# EAGLE schematic BMS MiniCAN Themistor Board Rev. 5 (EAGLE 7.7.0)
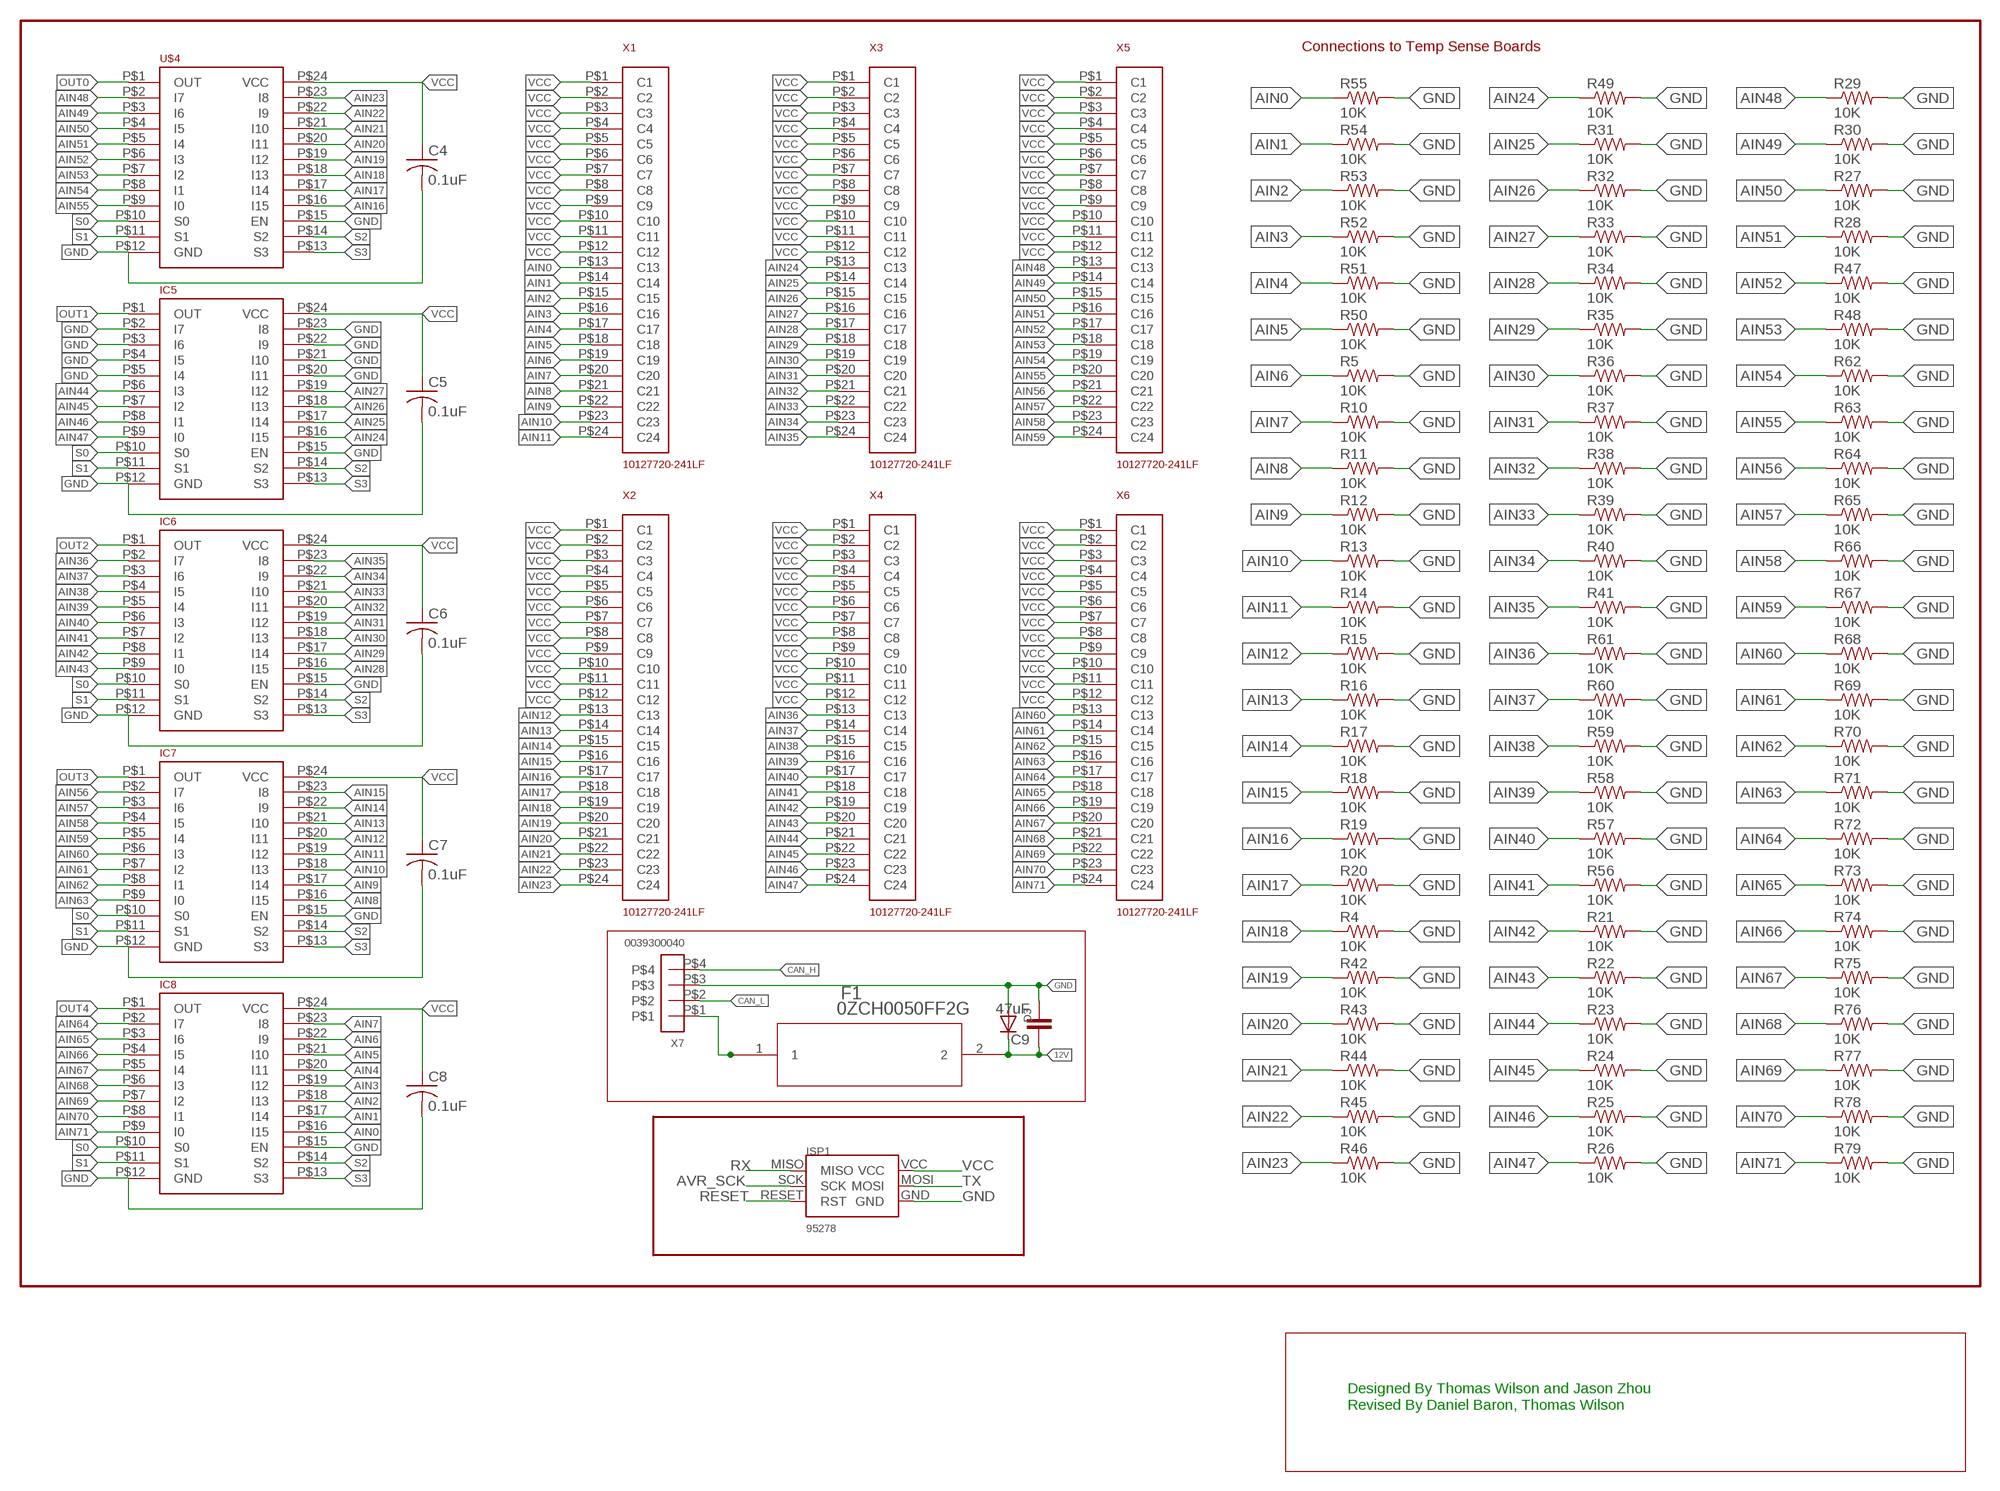
[diagram p0: schematic, sheet 1, part 1 of 2]
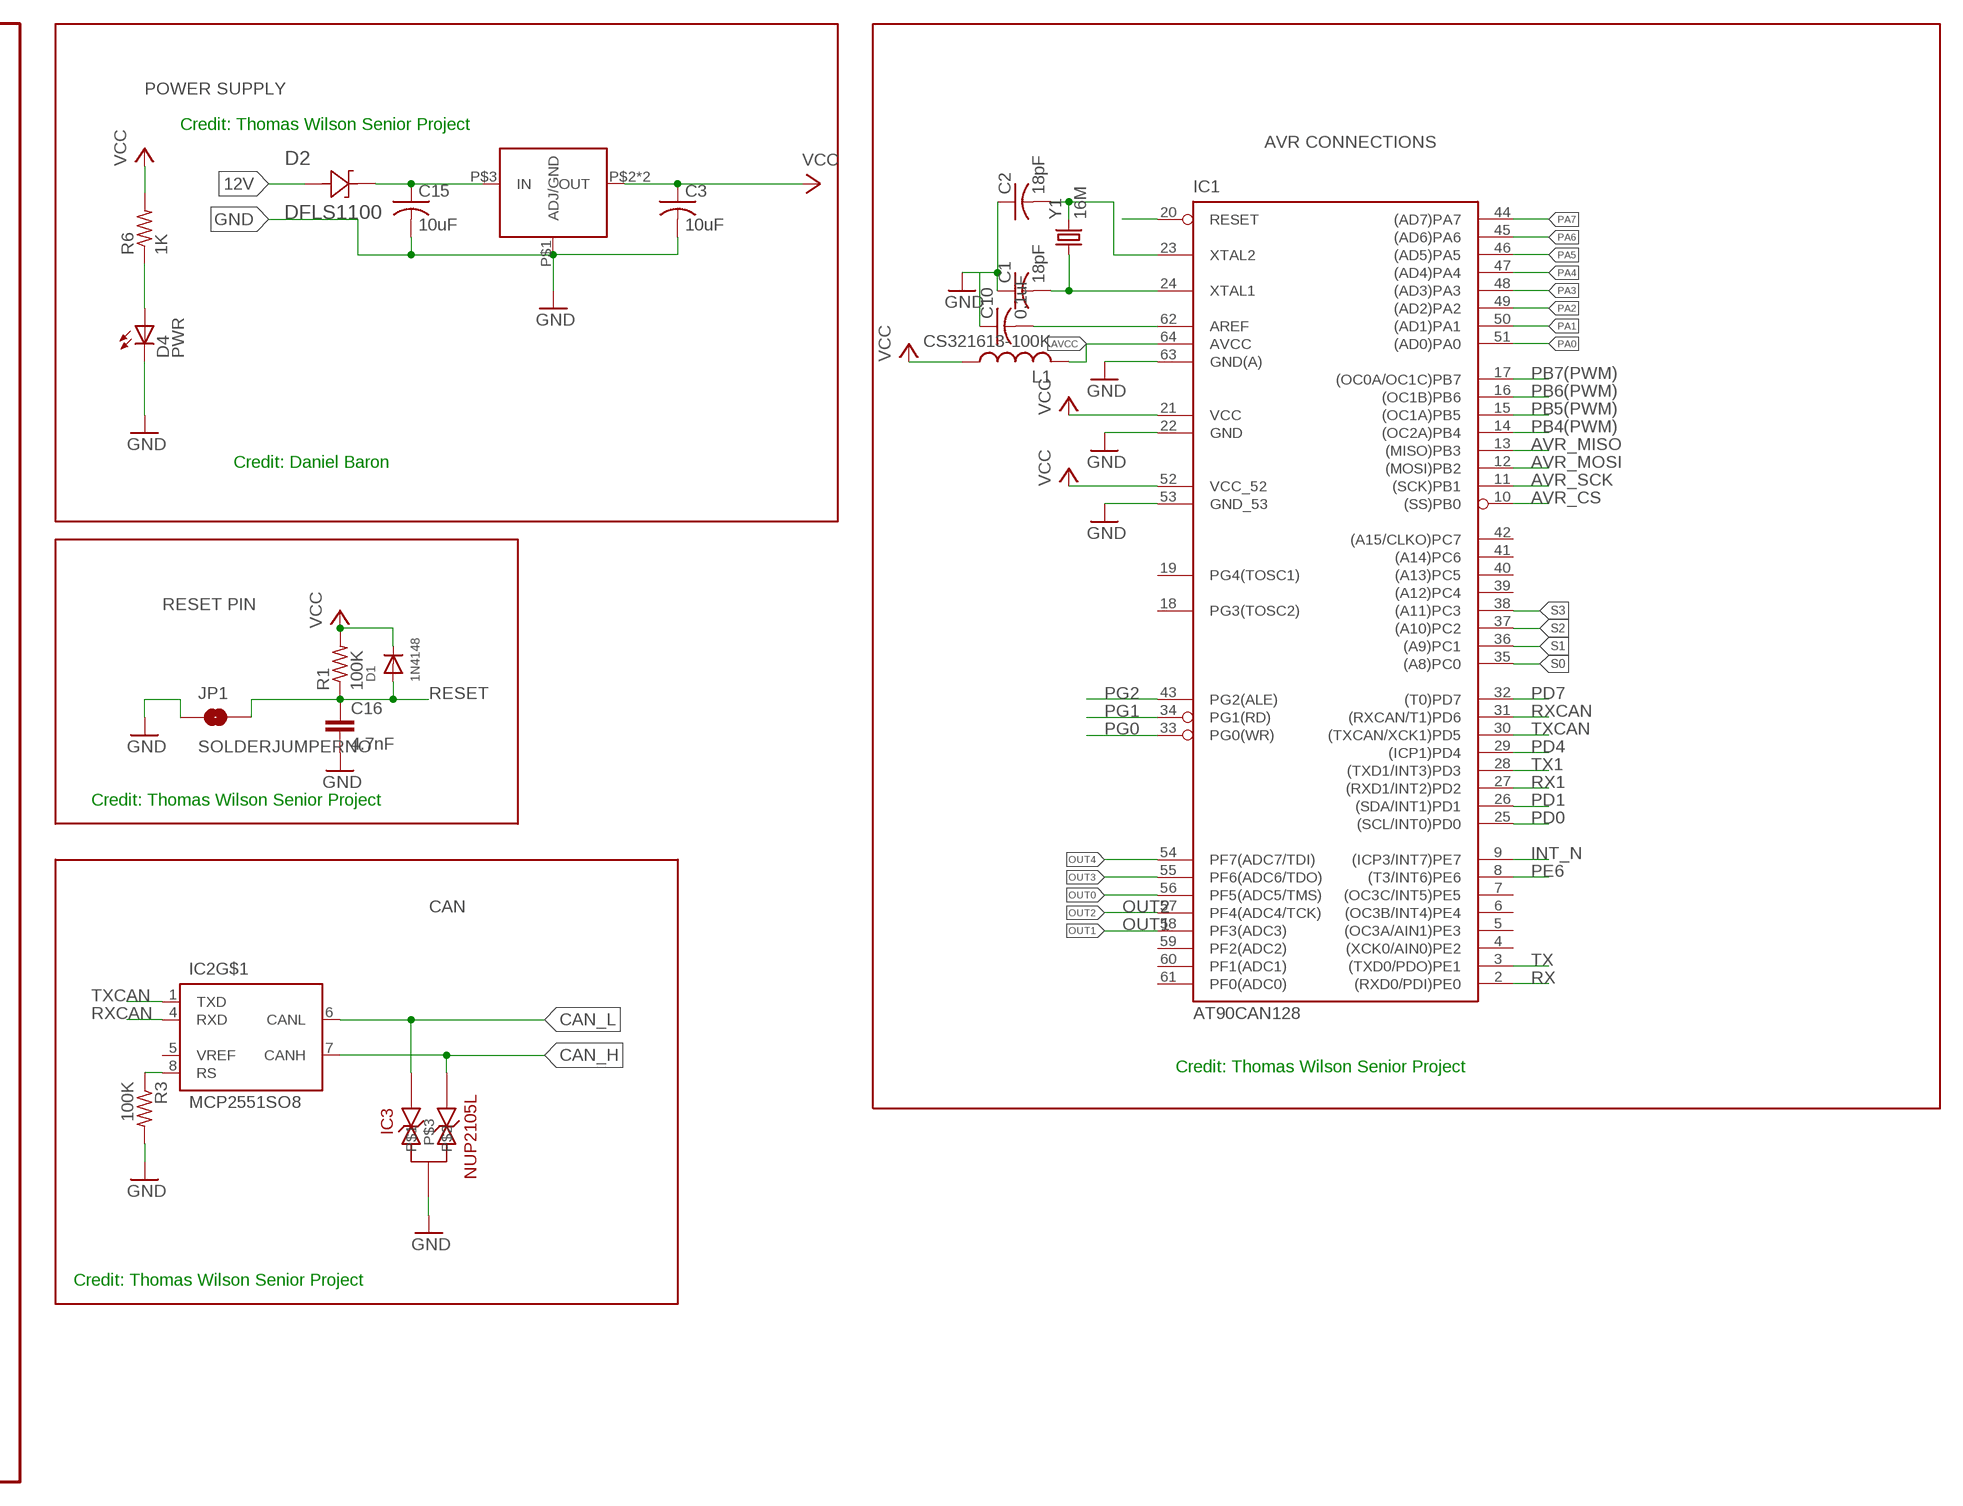
[diagram p1: schematic, sheet 1, part 2 of 2]

## Parts
C1  18pF  C-USC0805  [C0805]
C2  18pF  C-USC0805  [C0805]
C3  10uF  C-USC0805  [C0805]
C4  0.1uF  C-USC0805  [C0805]
C5  0.1uF  C-USC0805  [C0805]
C6  0.1uF  C-USC0805  [C0805]
C7  0.1uF  C-USC0805  [C0805]
C8  0.1uF  C-USC0805  [C0805]
C9  47uF  C-EUC0805  [C0805]
C10  0.1uF  C-USC0805  [C0805]
C15  10uF  C-USC0805  [C0805]
C16  4.7nF  CAP0603-CAP  [0603-CAP]
D1  1N4148  DIODESOD-123  [SOD-123]
D2  DFLS1100  [POWERDI-123]
D3  DIODESOD-323F  [SOD-323F]
D4  PWR  LEDCHIPLED_0805  [CHIPLED_0805]
F1  0ZCH0050FF2G  [0ZCH]
IC1  AT90CAN128  [TQFP64]
IC2  MCP2551SO8  [SO08]
IC3  NUP2105L  [SOT-23]
IC4  LM117MPX-5.0  [SOT223-4]
IC5  CD74HC4067  [24-SOIC]
IC6  CD74HC4067  [24-SOIC]
IC7  CD74HC4067  [24-SOIC]
IC8  CD74HC4067  [24-SOIC]
ISP1  95278  [6_PIN_.1PITCH]
JP1  SOLDERJUMPERNO  [SJ_2S-NO]
L1  CS321613-100K  L-USL3216C  [L3216C]
R1  100K  R-US_R0805  [R0805]
R3  100K  R-US_R0805  [R0805]
R4  10K  R-US_R0603  [R0603]
R5  10K  R-US_R0603  [R0603]
R6  1K  R-US_R0805  [R0805]
R10  10K  R-US_R0603  [R0603]
R11  10K  R-US_R0603  [R0603]
R12  10K  R-US_R0603  [R0603]
R13  10K  R-US_R0603  [R0603]
R14  10K  R-US_R0603  [R0603]
R15  10K  R-US_R0603  [R0603]
R16  10K  R-US_R0603  [R0603]
R17  10K  R-US_R0603  [R0603]
R18  10K  R-US_R0603  [R0603]
R19  10K  R-US_R0603  [R0603]
R20  10K  R-US_R0603  [R0603]
R21  10K  R-US_R0603  [R0603]
R22  10K  R-US_R0603  [R0603]
R23  10K  R-US_R0603  [R0603]
R24  10K  R-US_R0603  [R0603]
R25  10K  R-US_R0603  [R0603]
R26  10K  R-US_R0603  [R0603]
R27  10K  R-US_R0603  [R0603]
R28  10K  R-US_R0603  [R0603]
R29  10K  R-US_R0603  [R0603]
R30  10K  R-US_R0603  [R0603]
R31  10K  R-US_R0603  [R0603]
R32  10K  R-US_R0603  [R0603]
R33  10K  R-US_R0603  [R0603]
R34  10K  R-US_R0603  [R0603]
R35  10K  R-US_R0603  [R0603]
R36  10K  R-US_R0603  [R0603]
R37  10K  R-US_R0603  [R0603]
R38  10K  R-US_R0603  [R0603]
R39  10K  R-US_R0603  [R0603]
R40  10K  R-US_R0603  [R0603]
R41  10K  R-US_R0603  [R0603]
R42  10K  R-US_R0603  [R0603]
R43  10K  R-US_R0603  [R0603]
R44  10K  R-US_R0603  [R0603]
R45  10K  R-US_R0603  [R0603]
R46  10K  R-US_R0603  [R0603]
R47  10K  R-US_R0603  [R0603]
R48  10K  R-US_R0603  [R0603]
R49  10K  R-US_R0603  [R0603]
R50  10K  R-US_R0603  [R0603]
R51  10K  R-US_R0603  [R0603]
R52  10K  R-US_R0603  [R0603]
R53  10K  R-US_R0603  [R0603]
R54  10K  R-US_R0603  [R0603]
R55  10K  R-US_R0603  [R0603]
R56  10K  R-US_R0603  [R0603]
R57  10K  R-US_R0603  [R0603]
R58  10K  R-US_R0603  [R0603]
R59  10K  R-US_R0603  [R0603]
R60  10K  R-US_R0603  [R0603]
R61  10K  R-US_R0603  [R0603]
R62  10K  R-US_R0603  [R0603]
R63  10K  R-US_R0603  [R0603]
R64  10K  R-US_R0603  [R0603]
R65  10K  R-US_R0603  [R0603]
R66  10K  R-US_R0603  [R0603]
R67  10K  R-US_R0603  [R0603]
R68  10K  R-US_R0603  [R0603]
R69  10K  R-US_R0603  [R0603]
R70  10K  R-US_R0603  [R0603]
R71  10K  R-US_R0603  [R0603]
R72  10K  R-US_R0603  [R0603]
R73  10K  R-US_R0603  [R0603]
R74  10K  R-US_R0603  [R0603]
R75  10K  R-US_R0603  [R0603]
R76  10K  R-US_R0603  [R0603]
R77  10K  R-US_R0603  [R0603]
R78  10K  R-US_R0603  [R0603]
R79  10K  R-US_R0603  [R0603]
U$4  CD74HC4067  [24-SOIC]
X1  10127720-241LF  [10127720-241LF]
X2  10127720-241LF  [10127720-241LF]
X3  10127720-241LF  [10127720-241LF]
X4  10127720-241LF  [10127720-241LF]
X5  10127720-241LF  [10127720-241LF]
X6  10127720-241LF  [10127720-241LF]
X7  0039300040  [4_PIN_MOLEX]
Y1  16M  CRYSTALSMD  [HC49UP]

## Nets
12V: C9.1 D2.P$2 D3.C F1.2
12VIN: C15.1 D2.P$1 IC4.P$3(IN)
AIN0: IC8.P$16(I15) R55.1 X1.P$13(C13)
AIN1: IC8.P$17(I14) R54.1 X1.P$14(C14)
AIN2: IC8.P$18(I13) R53.1 X1.P$15(C15)
AIN3: IC8.P$19(I12) R52.1 X1.P$16(C16)
AIN4: IC8.P$20(I11) R51.1 X1.P$17(C17)
AIN5: IC8.P$21(I10) R50.1 X1.P$18(C18)
AIN6: IC8.P$22(I9) R5.1 X1.P$19(C19)
AIN7: IC8.P$23(I8) R10.1 X1.P$20(C20)
AIN8: IC7.P$16(I15) R11.1 X1.P$21(C21)
AIN9: IC7.P$17(I14) R12.1 X1.P$22(C22)
AIN10: IC7.P$18(I13) R13.1 X1.P$23(C23)
AIN11: IC7.P$19(I12) R14.1 X1.P$24(C24)
AIN12: IC7.P$20(I11) R15.1 X2.P$13(C13)
AIN13: IC7.P$21(I10) R16.1 X2.P$14(C14)
AIN14: IC7.P$22(I9) R17.1 X2.P$15(C15)
AIN15: IC7.P$23(I8) R18.1 X2.P$16(C16)
AIN16: R19.1 U$4.P$16(I15) X2.P$17(C17)
AIN17: R20.1 U$4.P$17(I14) X2.P$18(C18)
AIN18: R4.1 U$4.P$18(I13) X2.P$19(C19)
AIN19: R42.1 U$4.P$19(I12) X2.P$20(C20)
AIN20: R43.1 U$4.P$20(I11) X2.P$21(C21)
AIN21: R44.1 U$4.P$21(I10) X2.P$22(C22)
AIN22: R45.1 U$4.P$22(I9) X2.P$23(C23)
AIN23: R46.1 U$4.P$23(I8) X2.P$24(C24)
AIN24: IC5.P$16(I15) R49.1 X3.P$13(C13)
AIN25: IC5.P$17(I14) R31.1 X3.P$14(C14)
AIN26: IC5.P$18(I13) R32.1 X3.P$15(C15)
AIN27: IC5.P$19(I12) R33.1 X3.P$16(C16)
AIN28: IC6.P$16(I15) R34.1 X3.P$17(C17)
AIN29: IC6.P$17(I14) R35.1 X3.P$18(C18)
AIN30: IC6.P$18(I13) R36.1 X3.P$19(C19)
AIN31: IC6.P$19(I12) R37.1 X3.P$20(C20)
AIN32: IC6.P$20(I11) R38.1 X3.P$21(C21)
AIN33: IC6.P$21(I10) R39.1 X3.P$22(C22)
AIN34: IC6.P$22(I9) R40.1 X3.P$23(C23)
AIN35: IC6.P$23(I8) R41.1 X3.P$24(C24)
AIN36: IC6.P$2(I7) R61.1 X4.P$13(C13)
AIN37: IC6.P$3(I6) R60.1 X4.P$14(C14)
AIN38: IC6.P$4(I5) R59.1 X4.P$15(C15)
AIN39: IC6.P$5(I4) R58.1 X4.P$16(C16)
AIN40: IC6.P$6(I3) R57.1 X4.P$17(C17)
AIN41: IC6.P$7(I2) R56.1 X4.P$18(C18)
AIN42: IC6.P$8(I1) R21.1 X4.P$19(C19)
AIN43: IC6.P$9(I0) R22.1 X4.P$20(C20)
AIN44: IC5.P$6(I3) R23.1 X4.P$21(C21)
AIN45: IC5.P$7(I2) R24.1 X4.P$22(C22)
AIN46: IC5.P$8(I1) R25.1 X4.P$23(C23)
AIN47: IC5.P$9(I0) R26.1 X4.P$24(C24)
AIN48: R29.1 U$4.P$2(I7) X5.P$13(C13)
AIN49: R30.1 U$4.P$3(I6) X5.P$14(C14)
AIN50: R27.1 U$4.P$4(I5) X5.P$15(C15)
AIN51: R28.1 U$4.P$5(I4) X5.P$16(C16)
AIN52: R47.1 U$4.P$6(I3) X5.P$17(C17)
AIN53: R48.1 U$4.P$7(I2) X5.P$18(C18)
AIN54: R62.1 U$4.P$8(I1) X5.P$19(C19)
AIN55: R63.1 U$4.P$9(I0) X5.P$20(C20)
AIN56: IC7.P$2(I7) R64.1 X5.P$21(C21)
AIN57: IC7.P$3(I6) R65.1 X5.P$22(C22)
AIN58: IC7.P$4(I5) R66.1 X5.P$23(C23)
AIN59: IC7.P$5(I4) R67.1 X5.P$24(C24)
AIN60: IC7.P$6(I3) R68.1 X6.P$13(C13)
AIN61: IC7.P$7(I2) R69.1 X6.P$14(C14)
AIN62: IC7.P$8(I1) R70.1 X6.P$15(C15)
AIN63: IC7.P$9(I0) R71.1 X6.P$16(C16)
AIN64: IC8.P$2(I7) R72.1 X6.P$17(C17)
AIN65: IC8.P$3(I6) R73.1 X6.P$18(C18)
AIN66: IC8.P$4(I5) R74.1 X6.P$19(C19)
AIN67: IC8.P$5(I4) R75.1 X6.P$20(C20)
AIN68: IC8.P$6(I3) R76.1 X6.P$21(C21)
AIN69: IC8.P$7(I2) R77.1 X6.P$22(C22)
AIN70: IC8.P$8(I1) R78.1 X6.P$23(C23)
AIN71: IC8.P$9(I0) R79.1 X6.P$24(C24)
AREF: C10.2 IC1.62(AREF)
AVCC: IC1.64(AVCC) L1.2
AVR_CS: IC1.10((SS)PB0)
AVR_MISO: IC1.13((MISO)PB3)
AVR_MOSI: IC1.12((MOSI)PB2)
AVR_SCK: IC1.11((SCK)PB1) ISP1.SCK
CAN_H: IC2.7(CANH) IC3.2 X7.P$4
CAN_L: IC2.6(CANL) IC3.1 X7.P$2
GND: C1.1 C2.1 C3.2 C4.2 C5.2 C6.2 C7.2 C8.2 C9.2 C10.1 C15.2 C16.2 D3.A D4.C IC1.22(GND) IC1.53(GND_53) IC1.63(GND(A)) IC3.3 IC4.P$1(ADJ/GND) IC5.P$2(I7) IC5.P$3(I6) IC5.P$4(I5) IC5.P$5(I4) IC5.P$12(GND) IC5.P$15(EN) IC5.P$20(I11) IC5.P$21(I10) IC5.P$22(I9) IC5.P$23(I8) IC6.P$12(GND) IC6.P$15(EN) IC7.P$12(GND) IC7.P$15(EN) IC8.P$12(GND) IC8.P$15(EN) ISP1.GND JP1.1 R3.2 R4.2 R5.2 R10.2 R11.2 R12.2 R13.2 R14.2 R15.2 R16.2 R17.2 R18.2 R19.2 R20.2 R21.2 R22.2 R23.2 R24.2 R25.2 R26.2 R27.2 R28.2 R29.2 R30.2 R31.2 R32.2 R33.2 R34.2 R35.2 R36.2 R37.2 R38.2 R39.2 R40.2 R41.2 R42.2 R43.2 R44.2 R45.2 R46.2 R47.2 R48.2 R49.2 R50.2 R51.2 R52.2 R53.2 R54.2 R55.2 R56.2 R57.2 R58.2 R59.2 R60.2 R61.2 R62.2 R63.2 R64.2 R65.2 R66.2 R67.2 R68.2 R69.2 R70.2 R71.2 R72.2 R73.2 R74.2 R75.2 R76.2 R77.2 R78.2 R79.2 U$4.P$12(GND) U$4.P$15(EN) X7.P$3
INT_N: IC1.9((ICP3/INT7)PE7)
N$6: IC2.8(RS) R3.1
N$9: D4.A R6.1
OUT0: IC1.56(PF5(ADC5/TMS)) U$4.P$1(OUT)
OUT1: IC1.58(PF3(ADC3)) IC5.P$1(OUT)
OUT2: IC1.57(PF4(ADC4/TCK)) IC6.P$1(OUT)
OUT3: IC1.55(PF6(ADC6/TDO)) IC7.P$1(OUT)
OUT4: IC1.54(PF7(ADC7/TDI)) IC8.P$1(OUT)
PA0: IC1.51((AD0)PA0)
PA1: IC1.50((AD1)PA1)
PA2: IC1.49((AD2)PA2)
PA3: IC1.48((AD3)PA3)
PA4: IC1.47((AD4)PA4)
PA5: IC1.46((AD5)PA5)
PA6: IC1.45((AD6)PA6)
PA7: IC1.44((AD7)PA7)
PB4(PWM): IC1.14((OC2A)PB4)
PB5(PWM): IC1.15((OC1A)PB5)
PB6(PWM): IC1.16((OC1B)PB6)
PB7(PWM): IC1.17((OC0A/OC1C)PB7)
PD0: IC1.25((SCL/INT0)PD0)
PD1: IC1.26((SDA/INT1)PD1)
PD4: IC1.29((ICP1)PD4)
PD7: IC1.32((T0)PD7)
PE6: IC1.8((T3/INT6)PE6)
PG0: IC1.33(PG0(WR))
PG1: IC1.34(PG1(RD))
PG2: IC1.43(PG2(ALE))
RESET: C16.1 D1.A IC1.20(RESET) ISP1.RESET(RST) JP1.2 R1.1
RX: IC1.2((RXD0/PDI)PE0) ISP1.MISO
RX1: IC1.27((RXD1/INT2)PD2)
RXCAN: IC1.31((RXCAN/T1)PD6) IC2.4(RXD)
S0: IC1.35((A8)PC0) IC5.P$10(S0) IC6.P$10(S0) IC7.P$10(S0) IC8.P$10(S0) U$4.P$10(S0)
S1: IC1.36((A9)PC1) IC5.P$11(S1) IC6.P$11(S1) IC7.P$11(S1) IC8.P$11(S1) U$4.P$11(S1)
S2: IC1.37((A10)PC2) IC5.P$14(S2) IC6.P$14(S2) IC7.P$14(S2) IC8.P$14(S2) U$4.P$14(S2)
S3: IC1.38((A11)PC3) IC5.P$13(S3) IC6.P$13(S3) IC7.P$13(S3) IC8.P$13(S3) U$4.P$13(S3)
TX: IC1.3((TXD0/PDO)PE1) ISP1.MOSI
TX1: IC1.28((TXD1/INT3)PD3)
TXCAN: IC1.30((TXCAN/XCK1)PD5) IC2.1(TXD)
UF_12V: F1.1 X7.P$1
VCC: C3.1 C4.1 C5.1 C6.1 C7.1 C8.1 D1.C IC1.21(VCC) IC1.52(VCC_52) IC4.P$2(OUT) IC4.P$4(OUT) IC5.P$24(VCC) IC6.P$24(VCC) IC7.P$24(VCC) IC8.P$24(VCC) ISP1.VCC L1.1 R1.2 R6.2 U$4.P$24(VCC) X1.P$1(C1) X1.P$2(C2) X1.P$3(C3) X1.P$4(C4) X1.P$5(C5) X1.P$6(C6) X1.P$7(C7) X1.P$8(C8) X1.P$9(C9) X1.P$10(C10) X1.P$11(C11) X1.P$12(C12) X2.P$1(C1) X2.P$2(C2) X2.P$3(C3) X2.P$4(C4) X2.P$5(C5) X2.P$6(C6) X2.P$7(C7) X2.P$8(C8) X2.P$9(C9) X2.P$10(C10) X2.P$11(C11) X2.P$12(C12) X3.P$1(C1) X3.P$2(C2) X3.P$3(C3) X3.P$4(C4) X3.P$5(C5) X3.P$6(C6) X3.P$7(C7) X3.P$8(C8) X3.P$9(C9) X3.P$10(C10) X3.P$11(C11) X3.P$12(C12) X4.P$1(C1) X4.P$2(C2) X4.P$3(C3) X4.P$4(C4) X4.P$5(C5) X4.P$6(C6) X4.P$7(C7) X4.P$8(C8) X4.P$9(C9) X4.P$10(C10) X4.P$11(C11) X4.P$12(C12) X5.P$1(C1) X5.P$2(C2) X5.P$3(C3) X5.P$4(C4) X5.P$5(C5) X5.P$6(C6) X5.P$7(C7) X5.P$8(C8) X5.P$9(C9) X5.P$10(C10) X5.P$11(C11) X5.P$12(C12) X6.P$1(C1) X6.P$2(C2) X6.P$3(C3) X6.P$4(C4) X6.P$5(C5) X6.P$6(C6) X6.P$7(C7) X6.P$8(C8) X6.P$9(C9) X6.P$10(C10) X6.P$11(C11) X6.P$12(C12)
XTAL1: C1.2 IC1.24(XTAL1) Y1.1
XTAL2: C2.2 IC1.23(XTAL2) Y1.2
Unconnected: IC1.4((XCK0/AIN0)PE2) IC1.5((OC3A/AIN1)PE3) IC1.6((OC3B/INT4)PE4) IC1.7((OC3C/INT5)PE5) IC1.18(PG3(TOSC2)) IC1.19(PG4(TOSC1)) IC1.39((A12)PC4) IC1.40((A13)PC5) IC1.41((A14)PC6) IC1.42((A15/CLKO)PC7) IC1.59(PF2(ADC2)) IC1.60(PF1(ADC1)) IC1.61(PF0(ADC0)) IC2.5(VREF)

## Notes on the sheet
- Connections to Temp Sense Boards
- POWER SUPPLY
- Credit: Thomas Wilson Senior Project
- AVR CONNECTIONS
- Credit: Daniel Baron
- RESET PIN
- Credit: Thomas Wilson Senior Project
- CAN
- Credit: Thomas Wilson Senior Project
- Credit: Thomas Wilson Senior Project
- Designed By Thomas Wilson and Jason Zhou
  Revised By Daniel Baron, Thomas Wilson

## Power pins joined to a net without a drawn wire
GND: IC2.2(GND)
VCC: IC2.3(VCC)

## Library data of the parts
C1 C2 C4-C8 C10 = rcl:C-US: CAPACITOR, American symbol
C3 C15 = resistor:C-US: CAPACITOR, American symbol
C9 = rcl:C-EU: CAPACITOR, European symbol
C16 = SparkFun-Capacitors:CAP: Capacitor Standard 0603 ceramic capacitor, and 0.1" leaded capacitor.
D1 D3 = adafruit:DIODE: Diode SMADIODE - SMA Surface Mount Package 20V 1A Schottky Diode Digikey: 641-1014-6-ND DO-1N4148 - Through Hole Small Current Diode SOD-123 20V 1 A (.5mV Vf) Schottky Diode - Digikey: MBRX120TPMSCT-ND SOD-323 10V 570mA (.38mV Vf, 3ns) Schottky Diode - Digikey: ZLLS410CT-ND SOD-523 30V 30mA Schottky Diode (RB751S-40TE61) - Digikey: RB751S-40TE61CT-ND SOT23-R/W - SOT23 Package (R = Solder Paste/Reflow Ovens, W = Hand-Soldering) BAT54Film 40V 300mA - Digikey: 497-7162-1-ND
D2 = BMS Lbr:DFLS1100: 1.0A HIGH VOLTAGE SCHOTTKY BARRIER RECTIFIER
D4 = led:LED: LED OSRAM: - CHIPLED LG R971, LG N971, LY N971, LG Q971, LY Q971, LO R971, LY R971 LH N974, LH R974 LS Q976, LO Q976, LY Q976 LO Q996 - Hyper CHIPLED LW Q18S LB Q993, LB Q99A, LB R99A - SideLED LS A670, LO A670, LY A670, LG A670, LP A670 LB A673, LV A673, LT A673, LW A673 LH A674 LY A675 LS A676, LA A676, LO A676, LY A676, LW A676 LS A679, LY A679, LG A679 - Hyper Micro SIDELED® LS Y876, LA Y876, LO Y876, LY Y876 LT Y87S - SmartLED LW L88C, LW L88S LB L89C, LB L89S, LG L890 LS L89K, LO L89K, LY L89K LS L896, LA L896, LO L896, LY L896 - TOPLED LS T670, LO T670, LY T670, LG T670, LP T670 LSG T670, LSP T670, LSY T670, LOP T670, LYG T670 LG T671, LOG T671, LSG T671 LB T673, LV T673, LT T673, LW T673 LH T674 LS T676, LA T676, LO T676, LY T676, LB T676, LH T676, LSB T676, LW T676 LB T67C, LV T67C, LT T67C, LS T67K, LO T67K, LY T67K, LW E67C LS E67B, LA E67B, LO E67B, LY E67B, LB E67C, LV E67C, LT E67C LW T67C LS T679, LY T679, LG T679 LS T770, LO T770, LY T770, LG T770, LP T770 LB T773, LV T773, LT T773, LW T773 LH T774 LS E675, LA E675, LY E675, LS T675 LS T776, LA T776, LO T776, LY T776, LB T776 LHGB T686 LT T68C, LB T68C - Hyper Mini TOPLED® LB M676 - Mini TOPLED Santana® LG M470 LS M47K, LO M47K, LY M47K Source: http://www.osram.convergy.de LUXEON: - LUMILED® LXK2-PW12-R00, LXK2-PW12-S00, LXK2-PW14-U00, LXK2-PW14-V00 LXK2-PM12-R00, LXK2-PM12-S00, LXK2-PM14-U00 LXK2-PE12-Q00, LXK2-PE12-R00, LXK2-PE12-S00, LXK2-PE14-T00, LXK2-PE14-U00 LXK2-PB12-K00, LXK2-PB12-L00, LXK2-PB12-M00, LXK2-PB14-N00, LXK2-PB14-P00, LXK2-PB14-Q00 LXK2-PR12-L00, LXK2-PR12-M00, LXK2-PR14-Q00, LXK2-PR14-R00 LXK2-PD12-Q00, LXK2-PD12-R00, LXK2-PD12-S00 LXK2-PH12-R00, LXK2-PH12-S00 LXK2-PL12-P00, LXK2-PL12-Q00, LXK2-PL12-R00 Source: www.luxeon.com KINGBRIGHT: KA-3528ASYC Source: www.kingbright.com
F1 = BMS Lbr:0ZCH0050FF2G; COPYRIGHT: Copyright (C) 2016 Accelerated Designs. All rights reserved; MANUFACTURER_PART_NUMBER: 0ZCH0050FF2G; VENDOR: Belfuse
IC1 = at90can128:AT90CAN128
IC2 = can:MCP2551: CAN Tranceiver Microchip
IC3 = Artificial Science:NUP2105L
IC4 = BMS Lbr:LM117MPX-5.0: 5V fixed voltage regulator, 1%
IC5-IC8 U$4 = BMS Lbr:CD74HC4067: High-Speed CMOS Logic 16-Channel Analog Multiplexer/Demultiplexer
ISP1 = con-amphenol:95278: SMD ISP Connector
JP1 = SparkFun-Passives:SOLDERJUMPER: Solder Jumper Standard SMD solder jumper. Used to automate production. Two varients : Normally Open and Normally Closed are the same, but have different paste layers. NC will have a large amount of paste and should jumper during reflow.
L1 = rcl:L-US: INDUCTOR, American symbol
R1 R3 R6 = rcl:R-US_: RESISTOR, American symbol
R4 R5 R10-R79 = adafruit:R-US_: RESISTOR, American symbol
X1-X6 = con-amphenol:10127720-241LF: 24 Positions Plug Connector 0.118" (3.00mm) Through Hole, Right Angle Tin
X7 = BMS Lbr:0039300040: 4 Positions Header, Shrouded Connector 0.165" (4.20mm) Through Hole, Right Angle Tin
Y1 = SparkFun-FreqCtrl:CRYSTAL: Various standard crystals. Proven footprints. Spark Fun Electronics SKU : COM-00534